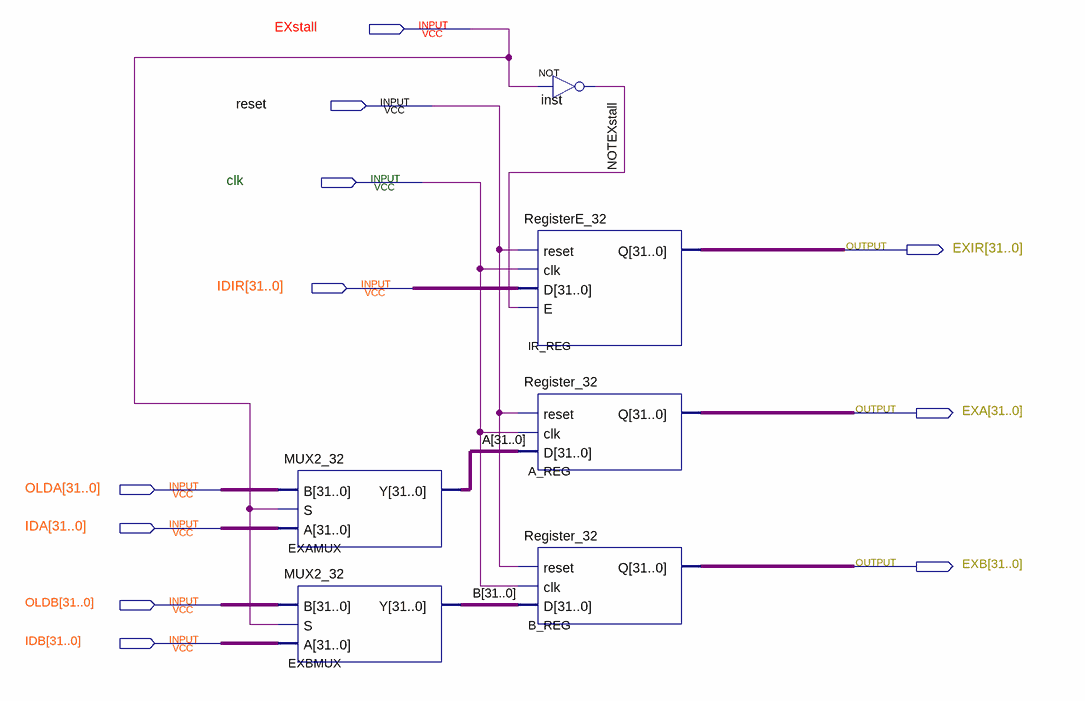
[diagram p0: schematic sheet]
// Quartus schematic IDEXTower.bdf as structural Verilog: 6 symbols, 11 pins
module IDEXTower (
  input  EXstall,
  input  reset,
  input  clk,
  input  [31:0] IDIR,
  input  [31:0] OLDA,
  input  [31:0] IDA,
  input  [31:0] OLDB,
  input  [31:0] IDB,
  output [31:0] EXIR,
  output [31:0] EXA,
  output [31:0] EXB
);

  wire NOTEXstall;
  wire [31:0] A, B;

  MUX2_32 EXAMUX (.B(OLDA), .S(EXstall), .A(IDA), .Y(A));
  MUX2_32 EXBMUX (.B(OLDB), .S(EXstall), .A(IDB), .Y(B));
  not inst (NOTEXstall, EXstall);
  RegisterE_32 IR_REG (.reset(reset), .clk(clk), .D(IDIR), .E(NOTEXstall), .Q(EXIR));
  Register_32 A_REG (.reset(reset), .clk(clk), .D(A), .Q(EXA));
  Register_32 B_REG (.reset(reset), .clk(clk), .D(B), .Q(EXB));
endmodule
